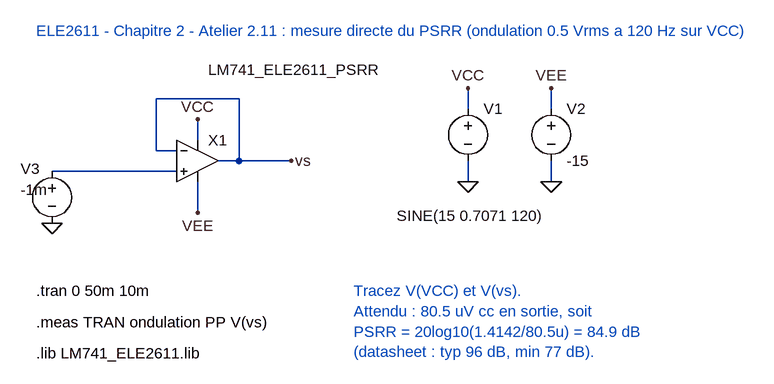
[diagram p0: schematic Ch2_Atelier_2_11_PSRR.asc]
Ch2_Atelier_2_11_PSRR.asc, the LTspice schematic file:
Version 4
SHEET 1 1200 700
WIRE 352 240 384 240
WIRE 384 144 384 240
WIRE 256 144 384 144
WIRE 256 144 256 224
WIRE 256 224 288 224
WIRE 320 176 320 208
WIRE 320 272 320 320
WIRE 384 240 464 240
WIRE 96 256 288 256
WIRE 736 128 736 160
WIRE 736 240 736 272
WIRE 864 128 864 160
WIRE 864 240 864 272
FLAG 320 176 VCC
FLAG 320 320 VEE
FLAG 464 240 vs
FLAG 96 336 0
FLAG 736 128 VCC
FLAG 736 272 0
FLAG 864 128 VEE
FLAG 864 272 0
SYMBOL Opamps\\opamp2 320 176 R0
WINDOW 3 16 -76 Left 2
SYMATTR InstName X1
SYMATTR Value LM741_ELE2611_PSRR
SYMBOL voltage 96 240 R0
WINDOW 0 -48 12 Left 2
WINDOW 3 -48 44 Left 2
SYMATTR InstName V3
SYMATTR Value -1m
SYMBOL voltage 736 144 R0
WINDOW 3 -110 180 Left 2
SYMATTR InstName V1
SYMATTR Value SINE(15 0.7071 120)
SYMBOL voltage 864 144 R0
SYMATTR InstName V2
SYMATTR Value -15
TEXT 72 40 Left 2 ;ELE2611 - Chapitre 2 - Atelier 2.11 : mesure directe du PSRR (ondulation 0.5 Vrms a 120 Hz sur VCC)
TEXT 72 440 Left 2 !.tran 0 50m 10m
TEXT 72 488 Left 2 !.meas TRAN ondulation PP V(vs)
TEXT 72 536 Left 2 !.lib LM741_ELE2611.lib
TEXT 560 440 Left 2 ;Tracez V(VCC) et V(vs).\nAttendu : 80.5 uV cc en sortie, soit\nPSRR = 20log10(1.4142/80.5u) = 84.9 dB\n(datasheet : typ 96 dB, min 77 dB).

The netlist it stands for:
* Ch2_Atelier_2_11_PSRR.asc
XX1 N001 vs VCC VEE vs LM741_ELE2611_PSRR  ; pins In+ In- V+ V- OUT
V3 N001 0 -1m
V1 VCC 0 SINE(15 0.7071 120)
V2 VEE 0 -15
* ELE2611 - Chapitre 2 - Atelier 2.11 : mesure directe du PSRR (ondulation 0.5 Vrms a 120 Hz sur VCC)
.tran 0 50m 10m
.meas TRAN ondulation PP V(vs)
.lib LM741_ELE2611.lib
* Tracez V(VCC) et V(vs).
* Attendu : 80.5 uV cc en sortie, soit
* PSRR = 20log10(1.4142/80.5u) = 84.9 dB
* (datasheet : typ 96 dB, min 77 dB).
.backanno
.end